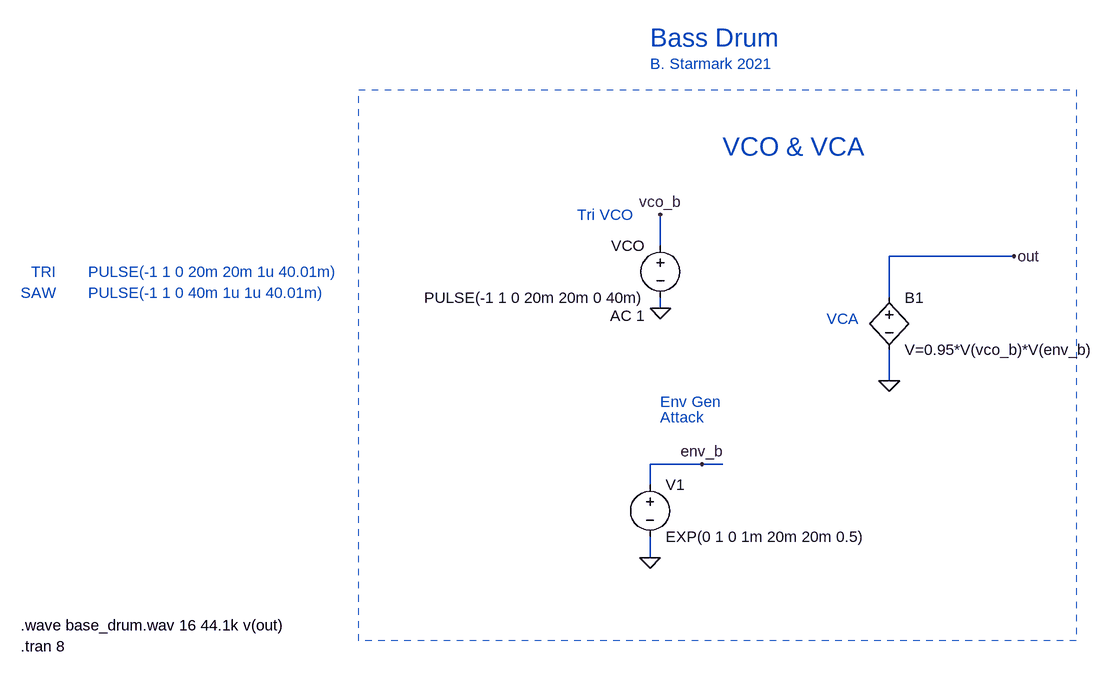
[diagram p0: schematic bass_drum.asc]
bass_drum.asc, the LTspice schematic file:
Version 4
SHEET 1 1536 2476
WIRE -1440 -768 -1440 -816
WIRE -896 -752 -1088 -752
WIRE -1088 -688 -1088 -752
WIRE -1440 -672 -1440 -688
WIRE -1088 -560 -1088 -608
WIRE -1376 -432 -1456 -432
WIRE -1344 -432 -1376 -432
WIRE -1456 -400 -1456 -432
WIRE -1456 -288 -1456 -320
FLAG -1440 -672 0
FLAG -1088 -560 0
FLAG -1440 -816 vco_b
FLAG -896 -752 out
FLAG -1456 -288 0
FLAG -1376 -432 env_b
SYMBOL voltage -1440 -784 M0
WINDOW 123 24 124 Left 2
WINDOW 39 0 0 Left 2
SYMATTR Value2 AC 1
SYMATTR InstName VCO
SYMATTR Value PULSE(-1 1 0 20m 20m 0 40m)
SYMBOL bv -1088 -704 R0
SYMATTR InstName B1
SYMATTR Value V=0.95*V(vco_b)*V(env_b)
SYMBOL voltage -1456 -416 R0
WINDOW 123 0 0 Left 0
WINDOW 39 0 0 Left 0
SYMATTR InstName V1
SYMATTR Value EXP(0 1 0 1m 20m 20m 0.5)
TEXT -1456 -1088 Left 4 ;Bass Drum
TEXT -1440 -504 Left 2 ;Attack
TEXT -1184 -656 Left 2 ;VCA
TEXT -1440 -528 Left 2 ;Env Gen
TEXT -1456 -1048 Left 2 ;B. Starmark 2021
TEXT -1344 -920 Left 4 ;VCO & VCA
TEXT -1568 -816 Left 2 ;Tri VCO
TEXT -2320 -696 Left 2 ;PULSE(-1 1 0 40m 1u 1u 40.01m)
TEXT -2424 -696 Left 2 ;SAW
TEXT -2320 -728 Left 2 ;PULSE(-1 1 0 20m 20m 1u 40.01m)
TEXT -2408 -728 Left 2 ;TRI
TEXT -2424 -152 Left 2 !.tran 8
TEXT -2424 -184 Left 2 !.wave base_drum.wav 16 44.1k v(out)
RECTANGLE Normal -800 -160 -1904 -1008 2

The netlist it stands for:
* bass_drum.asc
VCO vco_b 0 PULSE(-1 1 0 20m 20m 0 40m) AC 1
B1 out 0 V=0.95*V(vco_b)*V(env_b)
V1 env_b 0 EXP(0 1 0 1m 20m 20m 0.5)
* Bass Drum
* Attack
* VCA
* Env Gen
* B. Starmark 2021
* VCO & VCA
* Tri VCO
* PULSE(-1 1 0 40m 1u 1u 40.01m)
* SAW
* PULSE(-1 1 0 20m 20m 1u 40.01m)
* TRI
.tran 8
.wave base_drum.wav 16 44.1k v(out)
.backanno
.end